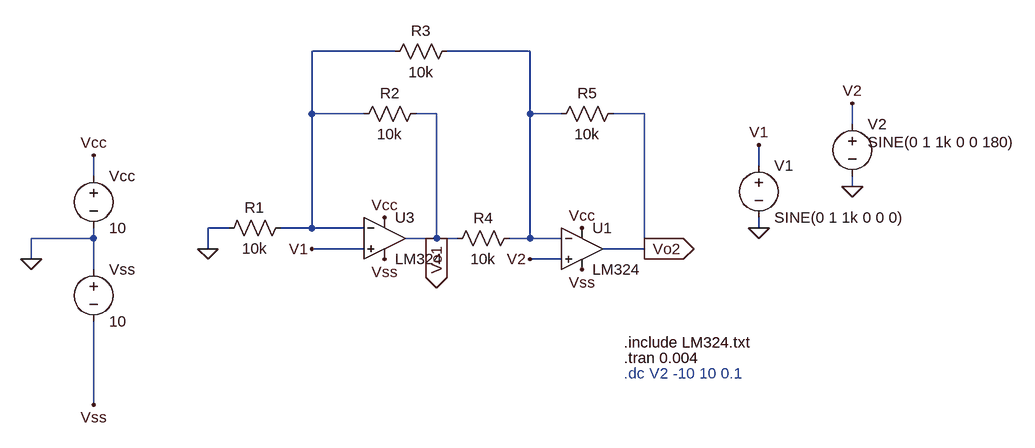
[diagram p0: schematic TP1_1.asc]
TP1_1.asc, the LTspice schematic file:
Version 4
SHEET 1 1120 680
WIRE 144 -128 16 -128
WIRE 352 -128 224 -128
WIRE 16 -32 16 -128
WIRE 96 -32 16 -32
WIRE 208 -32 176 -32
WIRE 352 -32 352 -128
WIRE 400 -32 352 -32
WIRE 528 -32 480 -32
WIRE 848 -16 848 -48
WIRE 704 48 704 16
WIRE -320 64 -320 32
WIRE 848 80 848 64
WIRE -112 144 -144 144
WIRE 16 144 16 -32
WIRE 16 144 -32 144
WIRE 96 144 16 144
WIRE 704 144 704 128
WIRE -320 160 -320 144
WIRE -320 160 -416 160
WIRE 208 160 208 -32
WIRE 208 160 160 160
WIRE 240 160 208 160
WIRE 352 160 352 -32
WIRE 352 160 320 160
WIRE 400 160 352 160
WIRE -144 176 -144 144
WIRE 96 176 16 176
WIRE 528 176 528 -32
WIRE 528 176 464 176
WIRE -416 192 -416 160
WIRE 400 192 352 192
WIRE -320 208 -320 160
WIRE -320 416 -320 288
FLAG -144 176 0
FLAG -416 192 0
FLAG 208 160 Vo1
IOPIN 208 160 Out
FLAG 528 176 Vo2
IOPIN 528 176 Out
FLAG 704 16 V1
FLAG 848 -48 V2
FLAG 704 144 0
FLAG 848 80 0
FLAG -320 32 Vcc
FLAG 128 128 Vcc
FLAG 432 144 Vcc
FLAG 128 192 Vss
FLAG 432 208 Vss
FLAG -320 416 Vss
FLAG 352 192 V2
FLAG 16 176 V1
SYMBOL res -16 128 R90
WINDOW 0 0 56 VBottom 2
WINDOW 3 32 56 VTop 2
SYMATTR InstName R1
SYMATTR Value 10k
SYMBOL res 192 -48 R90
WINDOW 0 0 56 VBottom 2
WINDOW 3 32 56 VTop 2
SYMATTR InstName R2
SYMATTR Value 10k
SYMBOL res 240 -144 R90
WINDOW 0 0 56 VBottom 2
WINDOW 3 32 56 VTop 2
SYMATTR InstName R3
SYMATTR Value 10k
SYMBOL res 336 144 R90
WINDOW 0 0 56 VBottom 2
WINDOW 3 32 56 VTop 2
SYMATTR InstName R4
SYMATTR Value 10k
SYMBOL res 496 -48 R90
WINDOW 0 0 56 VBottom 2
WINDOW 3 32 56 VTop 2
SYMATTR InstName R5
SYMATTR Value 10k
SYMBOL voltage -320 48 R0
WINDOW 123 0 0 Left 0
WINDOW 39 0 0 Left 0
SYMATTR InstName Vcc
SYMATTR Value 10
SYMBOL voltage -320 192 R0
WINDOW 123 0 0 Left 0
WINDOW 39 0 0 Left 0
SYMATTR InstName Vss
SYMATTR Value 10
SYMBOL voltage 704 32 R0
WINDOW 123 0 0 Left 0
WINDOW 39 0 0 Left 0
SYMATTR InstName V1
SYMATTR Value SINE(0 1 1k 0 0 0)
SYMBOL voltage 848 -32 R0
WINDOW 123 0 0 Left 0
WINDOW 39 0 0 Left 0
WINDOW 3 24 44 Left 2
SYMATTR InstName V2
SYMATTR Value SINE(0 1 1k 0 0 180)
SYMBOL OpAmps\\opamp2 128 96 R0
SYMATTR InstName U3
SYMATTR Value LM324
SYMBOL OpAmps\\opamp2 432 112 R0
SYMATTR InstName U1
SYMATTR Value LM324
TEXT 496 344 Left 2 !.tran 0.004
TEXT 496 320 Left 2 !.include LM324.txt
TEXT 496 368 Left 2 ;.dc V2 -10 10 0.1

The netlist it stands for:
* TP1_1.asc
R1 N001 0 10k
R2 Vo1 N001 10k
R3 N002 N001 10k
R4 N002 Vo1 10k
R5 Vo2 N002 10k
Vcc Vcc 0 10
Vss 0 Vss 10
V1 V1 0 SINE(0 1 1k 0 0 0)
V2 V2 0 SINE(0 1 1k 0 0 180)
XU3 V1 N001 Vcc Vss Vo1 LM324  ; pins In+ In- V+ V- OUT
XU1 V2 N002 Vcc Vss Vo2 LM324  ; pins In+ In- V+ V- OUT
.tran 0.004
.include LM324.txt
* .dc V2 -10 10 0.1
.backanno
.end